# Altium schematic sheet LEDs.SchDoc
size A
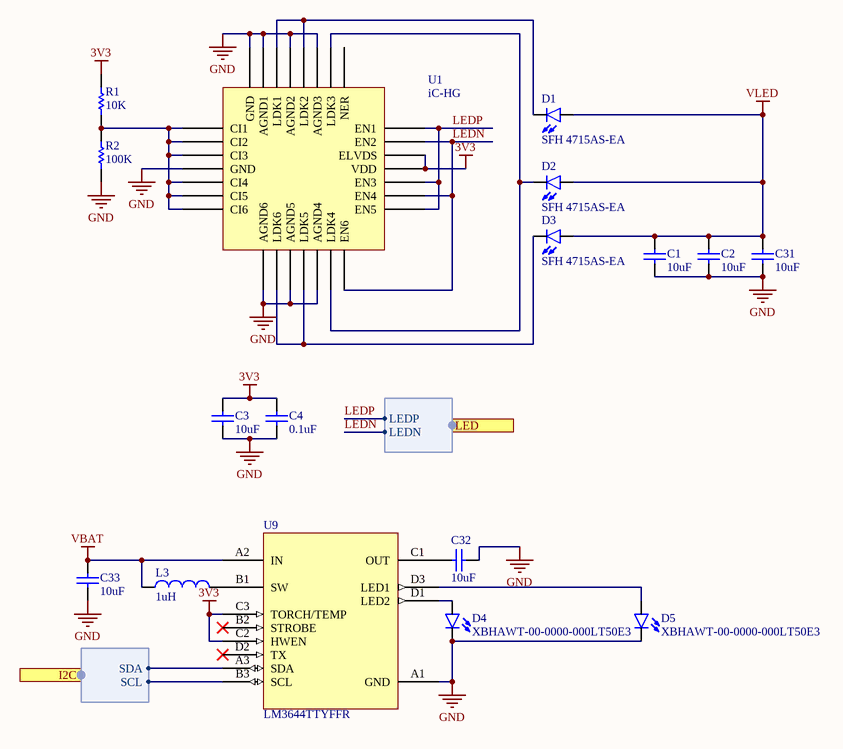
[diagram p0: LEDs.SchDoc]

## Parts
C1  value 10uF  [C0402[1005X55]]  (hidden comment: 10uF 6.3V 0402)
C2  value 10uF  [C0402[1005X55]]  (hidden comment: 10uF 6.3V 0402)
C3  value 10uF  [C0402[1005X55]]  (hidden comment: 10uF 6.3V 0402)
C4  value 0.1uF  [C0201[0603X30]]  (hidden comment: 0.1uF 6.3V 0201)
C31  value 10uF  [C0402[1005X55]]  (hidden comment: 10uF 6.3V 0402)
C32  value 10uF  [C0402[1005X55]]  (hidden comment: 10uF 6.3V 0402)
C33  value 10uF  [C0402[1005X55]]  (hidden comment: 10uF 6.3V 0402)
D1  SFH 4715AS-EA  [SFH 4715AS]
D2  SFH 4715AS-EA  [SFH 4715AS]
D3  SFH 4715AS-EA  [SFH 4715AS]
D4  XBHAWT-00-0000-000LT50E3  [XBHAWT]
D5  XBHAWT-00-0000-000LT50E3  [XBHAWT]
L3  1uH  [IND0402]
R1  value 10K  [R0402[1005]]  (hidden comment: 10K 1% 0402)
R2  value 100K  [R0402[1005]]  (hidden comment: 100K 1% 0402)
U1  iC-HG  [QFN-28]
U9  LM3644TTYFFR  [BGA-12]

## Ports
I2C (harness I2C), LED (harness LED)

## Harnesses
LED: LEDP, LEDN
I2C: SCL, SDA

## Nets
3V3: C3.2 C4.2 R1.2 U1.18(VDD) U1.19(ELVDS) U9.C2(HWEN) U9.C3(TORCH/TEMP)
GND: C1.1 C2.1 C3.1 C4.1 C31.1 C32.1 C33.1 D4.C D5.C R2.1 U1.4(GND) U1.8(AGND6) U1.10(AGND5) U1.12(AGND4) U1.24(AGND3) U1.26(AGND2) U1.28(AGND1) U1.29(GND) U9.A1(GND)
VBAT: C33.2 L3.1 U9.A2(IN)
VLED: C1.2 C2.2 C31.2 D1.A D2.A D3.A
LEDN: U1.14(EN6) U1.16(EN4) U1.20(EN2) ; port LED.LEDN
LEDP: U1.15(EN5) U1.17(EN3) U1.21(EN1) ; port LED.LEDP
NetC32_2: C32.2 U9.C1(OUT)
NetD1_C: D1.C U1.25(LDK2) U1.27(LDK1)
NetD2_C: D2.C U1.13(LDK4) U1.23(LDK3)
NetD3_C: D3.C U1.9(LDK6) U1.11(LDK5)
NetD4_A: D4.A U9.D1(LED2)
NetD5_A: D5.A U9.D3(LED1)
NetL3_2: L3.2 U9.B1(SW)
NetR1_1: R1.1 R2.2 U1.1(CI1) U1.2(CI2) U1.3(CI3) U1.5(CI4) U1.6(CI5) U1.7(CI6)
NetU9_A3: U9.A3(SDA) ; port I2C.SDA
NetU9_B3: U9.B3(SCL) ; port I2C.SCL

Not connected (* = marked no-connect by the designer): U1 22(NER); U9 B2(STROBE)* D2(TX)*

## Library data of the parts
C1-C3 C31-C33 = CAP_10uF_6.3V_0402_20%: 10uF 6.3V 20% 0402 (1005 Metric); PartNumber: GRM155R60J106ME44D; Manufacturer: Murata; Mounting Technology: Surface Mount; PackageReference: 0402; PackageDescription: 0402 (1005 Metric); Voltage: 6.3V; Tolerance: 20%
C4 = CAP_0.1uF_6.3V_0201_10%: 0.1uF 6.3V 10% 0201 (0603 Metric); PartNumber: GRT033R60J104KE01D; Manufacturer: Murata; Mounting Technology: Surface Mount; PackageReference: 0201; PackageDescription: 0201 (0603 Metric); Voltage: 6.3V; Tolerance: 10%
D1-D3 = SFH 4715AS-EA: Manufacturer: Osram; PartNumber: SFH 4715AS-EA; Mounting Technology: Surface Mount; Package Reference: SMD-3
D4 D5 = XBHAWT-00-0000-000LT50E3: Manufacturer: Cree, Inc.; PartNumber: XBHAWT-00-0000-000LT50E3; PackageReference: SMD-2; Mounting Technology: Surface Mount
L3 = IND_1uH_0.5A_0402_20%: 1uH 20% 0.5A 0402; PartNumber: MLP1005M1R0DT0S1; Manufacturer: Murata; PackageReference: 0402; PackageDescription: 0402 (2012 metric); Mounting Technology: Surface Mount; Current: 0.5A; Value: 1uH
R1 = RES_10K_0402_1%: 10K 0.063W 1% 0402 (1005 Metric); Manufacturer: KOA Speer; PartNumber: RK73H1ETTP1002F; Tolerance: 1%; Power: 0.063W; Mounting Technology: Surface Mount; PackageReference: 0402; PackageDescription: 0402 (1005 Metric); ComponentLink1Description: Datasheet; ComponentLink1URL: http://www.koaspeer.com/catimages/Products/RK73H/RK73H.pdf
R2 = RES_100K_0402_1%: 100K 0.063W 1% 0402 (1005 Metric); Manufacturer: KOA Speer; PartNumber: RK73H1ETTP1003F; Tolerance: 1%; Power: 0.063W; Mounting Technology: Surface Mount; PackageReference: 0402; PackageDescription: 0402 (1005 Metric); ComponentLink1Description: Datasheet; ComponentLink1URL: http://www.koaspeer.com/catimages/Products/RK73H/RK73H.pdf
U1 = iC-HG QFN28-5x5: Manufacturer: iC-Haus; PartNumber: iC-HG QFN28-5x5; Mounting Technology: Surface Mount; PackageReference: QFN-28
U9 = LM3644TTYFFR: LED Lighting Drivers 1.5 Amp LED driver; Manufacturer: Texas Instruments; PackageReference: BGA-12; Mounting Technology: Surface Mount; PartNumber: LM3644TTYFFR